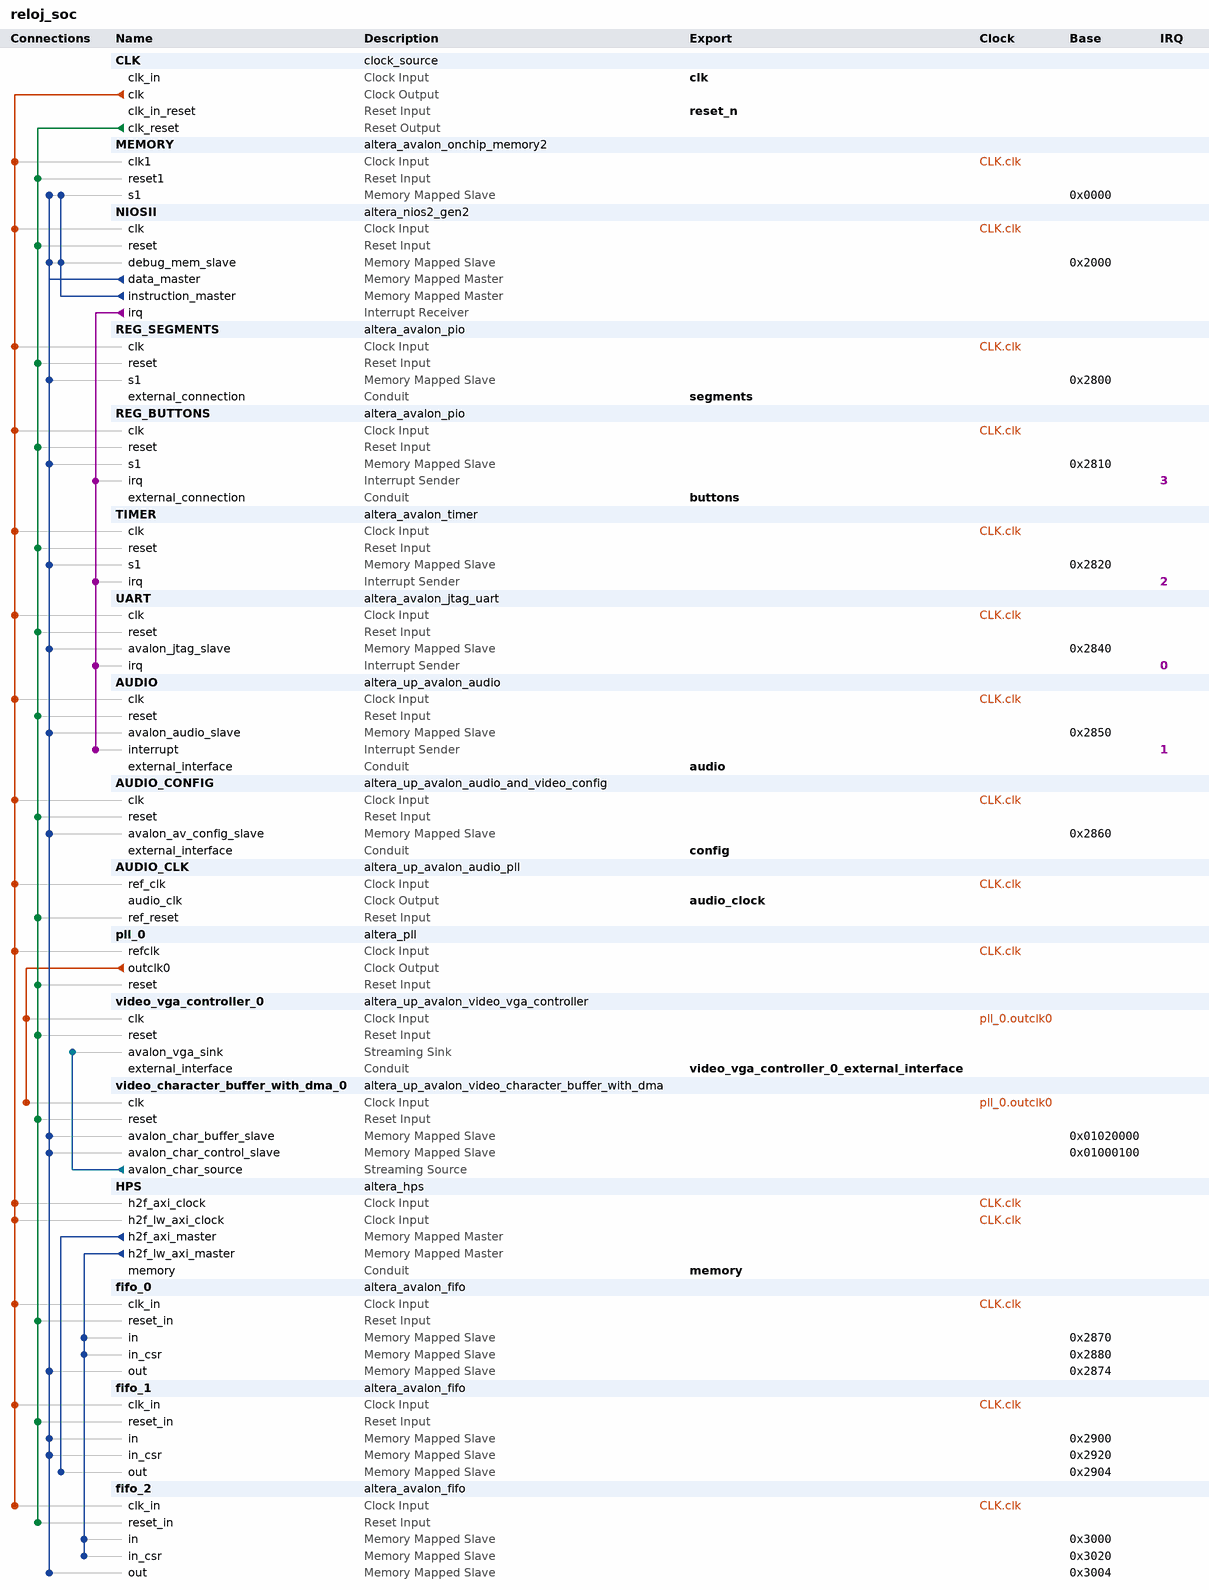
[diagram p0: system contents]
# Platform Designer (Qsys) system reloj_soc, Cyclone V 5CSEMA5F31C6
# Parameters at their usual value, and those the tool derives, are not listed.
package require -exact qsys 18.1
create_system reloj_soc
set_project_property DEVICE_FAMILY {Cyclone V}
set_project_property DEVICE 5CSEMA5F31C6

add_instance CLK clock_source 18.1
set_instance_parameter_value CLK clockFrequency 50000000

add_instance MEMORY altera_avalon_onchip_memory2 18.1
set_instance_parameter_value MEMORY dataWidth 32
set_instance_parameter_value MEMORY dualPort false
set_instance_parameter_value MEMORY initMemContent true
set_instance_parameter_value MEMORY initializationFileName onchip_mem.hex
set_instance_parameter_value MEMORY memorySize 8192
set_instance_parameter_value MEMORY singleClockOperation true

add_instance NIOSII altera_nios2_gen2 18.1
set_instance_parameter_value NIOSII dcache_size 2048
set_instance_parameter_value NIOSII exceptionSlave MEMORY.s1
set_instance_parameter_value NIOSII icache_size 4096
set_instance_parameter_value NIOSII impl Tiny
set_instance_parameter_value NIOSII resetSlave MEMORY.s1

add_instance REG_SEGMENTS altera_avalon_pio 18.1
set_instance_parameter_value REG_SEGMENTS direction Output
set_instance_parameter_value REG_SEGMENTS width 28

add_instance REG_BUTTONS altera_avalon_pio 18.1
set_instance_parameter_value REG_BUTTONS bitClearingEdgeCapReg true
set_instance_parameter_value REG_BUTTONS captureEdge true
set_instance_parameter_value REG_BUTTONS direction Input
set_instance_parameter_value REG_BUTTONS edgeType FALLING
set_instance_parameter_value REG_BUTTONS generateIRQ true
set_instance_parameter_value REG_BUTTONS irqType EDGE
set_instance_parameter_value REG_BUTTONS width 4

add_instance TIMER altera_avalon_timer 18.1
set_instance_parameter_value TIMER fixedPeriod true
set_instance_parameter_value TIMER period 1
set_instance_parameter_value TIMER periodUnits SEC

add_instance UART altera_avalon_jtag_uart 18.1
set_instance_parameter_value UART simInteractiveOptions NO_INTERACTIVE_WINDOWS

add_instance AUDIO altera_up_avalon_audio 18.0
set_instance_parameter_value AUDIO audio_in true
set_instance_parameter_value AUDIO avalon_bus_type {Memory Mapped}
set_instance_parameter_value AUDIO dw 24

add_instance AUDIO_CONFIG altera_up_avalon_audio_and_video_config 18.0
set_instance_parameter_value AUDIO_CONFIG audio_in {Microphone to ADC}
set_instance_parameter_value AUDIO_CONFIG bit_length 24
set_instance_parameter_value AUDIO_CONFIG board DE1-SoC
set_instance_parameter_value AUDIO_CONFIG line_in_bypass false
set_instance_parameter_value AUDIO_CONFIG sampling_rate {48 kHz}

add_instance AUDIO_CLK altera_up_avalon_audio_pll 18.0
set_instance_parameter_value AUDIO_CLK gui_refclk 50.0

add_instance pll_0 altera_pll 18.1
set_instance_parameter_value pll_0 gui_device_speed_grade 1
set_instance_parameter_value pll_0 gui_number_of_clocks 1
set_instance_parameter_value pll_0 gui_operation_mode direct
set_instance_parameter_value pll_0 gui_output_clock_frequency0 25.0
set_instance_parameter_value pll_0 gui_pll_mode {Integer-N PLL}
set_instance_parameter_value pll_0 gui_reference_clock_frequency 50.0
set_instance_parameter_value pll_0 gui_use_locked true

add_instance video_vga_controller_0 altera_up_avalon_video_vga_controller 18.0
set_instance_parameter_value video_vga_controller_0 board DE1-SoC
set_instance_parameter_value video_vga_controller_0 resolution {VGA 640x480}

add_instance video_character_buffer_with_dma_0 altera_up_avalon_video_character_buffer_with_dma 18.0
set_instance_parameter_value video_character_buffer_with_dma_0 enable_transparency false

add_instance HPS altera_hps 18.1
set_instance_parameter_value HPS EMAC1_Mode N/A
set_instance_parameter_value HPS EMAC1_PinMuxing Unused
set_instance_parameter_value HPS F2SCLK_COLDRST_Enable false
set_instance_parameter_value HPS F2SCLK_DBGRST_Enable false
set_instance_parameter_value HPS F2SCLK_WARMRST_Enable false
set_instance_parameter_value HPS F2SINTERRUPT_Enable false
set_instance_parameter_value HPS F2S_Width 0
set_instance_parameter_value HPS FPGA_PERIPHERAL_OUTPUT_CLOCK_FREQ_EMAC0_GTX_CLK 125
set_instance_parameter_value HPS FPGA_PERIPHERAL_OUTPUT_CLOCK_FREQ_EMAC0_MD_CLK 2.5
set_instance_parameter_value HPS FPGA_PERIPHERAL_OUTPUT_CLOCK_FREQ_EMAC1_GTX_CLK 125
set_instance_parameter_value HPS FPGA_PERIPHERAL_OUTPUT_CLOCK_FREQ_EMAC1_MD_CLK 2.5
set_instance_parameter_value HPS HPS_PROTOCOL DDR3
set_instance_parameter_value HPS I2C0_Mode N/A
set_instance_parameter_value HPS I2C0_PinMuxing Unused
set_instance_parameter_value HPS I2C1_Mode N/A
set_instance_parameter_value HPS I2C1_PinMuxing Unused
set_instance_parameter_value HPS LWH2F_Enable true
set_instance_parameter_value HPS MEM_BANKADDR_WIDTH 3
set_instance_parameter_value HPS MEM_CLK_FREQ 300.0
set_instance_parameter_value HPS MEM_CLK_FREQ_MAX 400.0
set_instance_parameter_value HPS MEM_COL_ADDR_WIDTH 8
set_instance_parameter_value HPS MEM_DQ_WIDTH 8
set_instance_parameter_value HPS MEM_DRV_STR RZQ/6
set_instance_parameter_value HPS MEM_ROW_ADDR_WIDTH 12
set_instance_parameter_value HPS MEM_RTT_NOM {ODT Disabled}
set_instance_parameter_value HPS MEM_RTT_WR {Dynamic ODT off}
set_instance_parameter_value HPS MEM_TCL 7
set_instance_parameter_value HPS MEM_TFAW_NS 37.5
set_instance_parameter_value HPS MEM_TINIT_US 499
set_instance_parameter_value HPS MEM_TMRD_CK 3
set_instance_parameter_value HPS MEM_TRAS_NS 40.0
set_instance_parameter_value HPS MEM_TRCD_NS 15.0
set_instance_parameter_value HPS MEM_TREFI_US 7.0
set_instance_parameter_value HPS MEM_TRFC_NS 75.0
set_instance_parameter_value HPS MEM_TRP_NS 15.0
set_instance_parameter_value HPS MEM_TWTR 2
set_instance_parameter_value HPS MEM_VENDOR JEDEC
set_instance_parameter_value HPS MEM_WTCL 6
set_instance_parameter_value HPS QSPI_Mode N/A
set_instance_parameter_value HPS QSPI_PinMuxing Unused
set_instance_parameter_value HPS REF_CLK_FREQ 125.0
set_instance_parameter_value HPS S2FCLK_USER2CLK 5
set_instance_parameter_value HPS S2F_Width 1
set_instance_parameter_value HPS SDIO_Mode N/A
set_instance_parameter_value HPS SDIO_PinMuxing Unused
set_instance_parameter_value HPS SPIM1_Mode N/A
set_instance_parameter_value HPS SPIM1_PinMuxing Unused
set_instance_parameter_value HPS STM_Enable false
set_instance_parameter_value HPS TIMING_BOARD_AC_SKEW 0.02
set_instance_parameter_value HPS TIMING_BOARD_AC_TO_CK_SKEW 0.0
set_instance_parameter_value HPS TIMING_BOARD_DQ_TO_DQS_SKEW 0.0
set_instance_parameter_value HPS TIMING_BOARD_MAX_CK_DELAY 0.6
set_instance_parameter_value HPS TIMING_BOARD_MAX_DQS_DELAY 0.6
set_instance_parameter_value HPS TIMING_BOARD_SKEW_BETWEEN_DQS 0.02
set_instance_parameter_value HPS TIMING_BOARD_SKEW_CKDQS_DIMM_MAX 0.01
set_instance_parameter_value HPS TIMING_BOARD_SKEW_CKDQS_DIMM_MIN -0.01
set_instance_parameter_value HPS TIMING_BOARD_SKEW_WITHIN_DQS 0.02
set_instance_parameter_value HPS TIMING_TDH 125
set_instance_parameter_value HPS TIMING_TDQSCK 400
set_instance_parameter_value HPS TIMING_TDQSQ 120
set_instance_parameter_value HPS TIMING_TDS 50
set_instance_parameter_value HPS TIMING_TIH 250
set_instance_parameter_value HPS TIMING_TIS 175
set_instance_parameter_value HPS TIMING_TQSH 0.38
set_instance_parameter_value HPS UART0_Mode N/A
set_instance_parameter_value HPS UART0_PinMuxing Unused
set_instance_parameter_value HPS USB1_Mode N/A
set_instance_parameter_value HPS USB1_PinMuxing Unused
set_instance_parameter_value HPS desired_cfg_clk_mhz 100.0
set_instance_parameter_value HPS desired_qspi_clk_mhz 400.0
set_instance_parameter_value HPS eosc1_clk_mhz 50.0
set_instance_parameter_value HPS eosc2_clk_mhz 50.0

add_instance fifo_0 altera_avalon_fifo 18.1
set_instance_parameter_value fifo_0 bitsPerSymbol 16
set_instance_parameter_value fifo_0 channelWidth 8
set_instance_parameter_value fifo_0 errorWidth 8
set_instance_parameter_value fifo_0 fifoDepth 16
set_instance_parameter_value fifo_0 fifoInputInterfaceOptions AVALONMM_WRITE
set_instance_parameter_value fifo_0 fifoOutputInterfaceOptions AVALONMM_READ
set_instance_parameter_value fifo_0 singleClockMode true
set_instance_parameter_value fifo_0 symbolsPerBeat 2
set_instance_parameter_value fifo_0 useIRQ false
set_instance_parameter_value fifo_0 usePacket true
set_instance_parameter_value fifo_0 useReadControl false

add_instance fifo_1 altera_avalon_fifo 18.1
set_instance_parameter_value fifo_1 bitsPerSymbol 16
set_instance_parameter_value fifo_1 channelWidth 8
set_instance_parameter_value fifo_1 errorWidth 8
set_instance_parameter_value fifo_1 fifoDepth 16
set_instance_parameter_value fifo_1 fifoInputInterfaceOptions AVALONMM_WRITE
set_instance_parameter_value fifo_1 fifoOutputInterfaceOptions AVALONMM_READ
set_instance_parameter_value fifo_1 singleClockMode true
set_instance_parameter_value fifo_1 symbolsPerBeat 2
set_instance_parameter_value fifo_1 useIRQ false
set_instance_parameter_value fifo_1 usePacket true
set_instance_parameter_value fifo_1 useReadControl false

add_instance fifo_2 altera_avalon_fifo 18.1
set_instance_parameter_value fifo_2 bitsPerSymbol 16
set_instance_parameter_value fifo_2 channelWidth 8
set_instance_parameter_value fifo_2 errorWidth 8
set_instance_parameter_value fifo_2 fifoDepth 16
set_instance_parameter_value fifo_2 fifoInputInterfaceOptions AVALONMM_WRITE
set_instance_parameter_value fifo_2 fifoOutputInterfaceOptions AVALONMM_READ
set_instance_parameter_value fifo_2 singleClockMode true
set_instance_parameter_value fifo_2 symbolsPerBeat 2
set_instance_parameter_value fifo_2 useIRQ false
set_instance_parameter_value fifo_2 usePacket true
set_instance_parameter_value fifo_2 useReadControl false

# connections
add_connection CLK.clk AUDIO.clk clock
add_connection CLK.clk AUDIO_CLK.ref_clk clock
add_connection CLK.clk AUDIO_CONFIG.clk clock
add_connection CLK.clk fifo_0.clk_in clock
add_connection CLK.clk fifo_1.clk_in clock
add_connection CLK.clk fifo_2.clk_in clock
add_connection CLK.clk HPS.h2f_axi_clock clock
add_connection CLK.clk HPS.h2f_lw_axi_clock clock
add_connection CLK.clk MEMORY.clk1 clock
add_connection CLK.clk NIOSII.clk clock
add_connection CLK.clk pll_0.refclk clock
add_connection CLK.clk REG_BUTTONS.clk clock
add_connection CLK.clk REG_SEGMENTS.clk clock
add_connection CLK.clk TIMER.clk clock
add_connection CLK.clk UART.clk clock
add_connection pll_0.outclk0 video_character_buffer_with_dma_0.clk clock
add_connection pll_0.outclk0 video_vga_controller_0.clk clock
add_connection CLK.clk_reset AUDIO.reset reset
add_connection CLK.clk_reset AUDIO_CLK.ref_reset reset
add_connection CLK.clk_reset AUDIO_CONFIG.reset reset
add_connection CLK.clk_reset fifo_0.reset_in reset
add_connection CLK.clk_reset fifo_1.reset_in reset
add_connection CLK.clk_reset fifo_2.reset_in reset
add_connection CLK.clk_reset MEMORY.reset1 reset
add_connection CLK.clk_reset NIOSII.reset reset
add_connection CLK.clk_reset pll_0.reset reset
add_connection CLK.clk_reset REG_BUTTONS.reset reset
add_connection CLK.clk_reset REG_SEGMENTS.reset reset
add_connection CLK.clk_reset TIMER.reset reset
add_connection CLK.clk_reset UART.reset reset
add_connection CLK.clk_reset video_character_buffer_with_dma_0.reset reset
add_connection CLK.clk_reset video_vga_controller_0.reset reset
add_connection HPS.h2f_axi_master fifo_1.out avalon
set_connection_parameter_value HPS.h2f_axi_master/fifo_1.out baseAddress 0x2904
add_connection HPS.h2f_lw_axi_master fifo_0.in avalon
set_connection_parameter_value HPS.h2f_lw_axi_master/fifo_0.in baseAddress 0x2870
add_connection HPS.h2f_lw_axi_master fifo_0.in_csr avalon
set_connection_parameter_value HPS.h2f_lw_axi_master/fifo_0.in_csr baseAddress 0x2880
add_connection HPS.h2f_lw_axi_master fifo_2.in avalon
set_connection_parameter_value HPS.h2f_lw_axi_master/fifo_2.in baseAddress 0x3000
add_connection HPS.h2f_lw_axi_master fifo_2.in_csr avalon
set_connection_parameter_value HPS.h2f_lw_axi_master/fifo_2.in_csr baseAddress 0x3020
add_connection NIOSII.data_master AUDIO.avalon_audio_slave avalon
set_connection_parameter_value NIOSII.data_master/AUDIO.avalon_audio_slave baseAddress 0x2850
add_connection NIOSII.data_master AUDIO_CONFIG.avalon_av_config_slave avalon
set_connection_parameter_value NIOSII.data_master/AUDIO_CONFIG.avalon_av_config_slave baseAddress 0x2860
add_connection NIOSII.data_master fifo_0.out avalon
set_connection_parameter_value NIOSII.data_master/fifo_0.out baseAddress 0x2874
add_connection NIOSII.data_master fifo_1.in avalon
set_connection_parameter_value NIOSII.data_master/fifo_1.in baseAddress 0x2900
add_connection NIOSII.data_master fifo_1.in_csr avalon
set_connection_parameter_value NIOSII.data_master/fifo_1.in_csr baseAddress 0x2920
add_connection NIOSII.data_master fifo_2.out avalon
set_connection_parameter_value NIOSII.data_master/fifo_2.out baseAddress 0x3004
add_connection NIOSII.data_master MEMORY.s1 avalon
set_connection_parameter_value NIOSII.data_master/MEMORY.s1 baseAddress 0x0000
add_connection NIOSII.data_master NIOSII.debug_mem_slave avalon
set_connection_parameter_value NIOSII.data_master/NIOSII.debug_mem_slave baseAddress 0x2000
add_connection NIOSII.data_master REG_BUTTONS.s1 avalon
set_connection_parameter_value NIOSII.data_master/REG_BUTTONS.s1 baseAddress 0x2810
add_connection NIOSII.data_master REG_SEGMENTS.s1 avalon
set_connection_parameter_value NIOSII.data_master/REG_SEGMENTS.s1 baseAddress 0x2800
add_connection NIOSII.data_master TIMER.s1 avalon
set_connection_parameter_value NIOSII.data_master/TIMER.s1 baseAddress 0x2820
add_connection NIOSII.data_master UART.avalon_jtag_slave avalon
set_connection_parameter_value NIOSII.data_master/UART.avalon_jtag_slave baseAddress 0x2840
add_connection NIOSII.data_master video_character_buffer_with_dma_0.avalon_char_buffer_slave avalon
set_connection_parameter_value NIOSII.data_master/video_character_buffer_with_dma_0.avalon_char_buffer_slave baseAddress 0x01020000
add_connection NIOSII.data_master video_character_buffer_with_dma_0.avalon_char_control_slave avalon
set_connection_parameter_value NIOSII.data_master/video_character_buffer_with_dma_0.avalon_char_control_slave baseAddress 0x01000100
add_connection NIOSII.instruction_master MEMORY.s1 avalon
set_connection_parameter_value NIOSII.instruction_master/MEMORY.s1 baseAddress 0x0000
add_connection NIOSII.instruction_master NIOSII.debug_mem_slave avalon
set_connection_parameter_value NIOSII.instruction_master/NIOSII.debug_mem_slave baseAddress 0x2000
add_connection video_character_buffer_with_dma_0.avalon_char_source video_vga_controller_0.avalon_vga_sink avalon_streaming
add_connection NIOSII.irq AUDIO.interrupt interrupt
set_connection_parameter_value NIOSII.irq/AUDIO.interrupt irqNumber 1
add_connection NIOSII.irq REG_BUTTONS.irq interrupt
set_connection_parameter_value NIOSII.irq/REG_BUTTONS.irq irqNumber 3
add_connection NIOSII.irq TIMER.irq interrupt
set_connection_parameter_value NIOSII.irq/TIMER.irq irqNumber 2
add_connection NIOSII.irq UART.irq interrupt
set_connection_parameter_value NIOSII.irq/UART.irq irqNumber 0

# exported interfaces
add_interface audio conduit end
set_interface_property audio EXPORT_OF AUDIO.external_interface
add_interface audio_clock clock source
set_interface_property audio_clock EXPORT_OF AUDIO_CLK.audio_clk
add_interface buttons conduit end
set_interface_property buttons EXPORT_OF REG_BUTTONS.external_connection
add_interface clk clock sink
set_interface_property clk EXPORT_OF CLK.clk_in
add_interface config conduit end
set_interface_property config EXPORT_OF AUDIO_CONFIG.external_interface
add_interface memory conduit end
set_interface_property memory EXPORT_OF HPS.memory
add_interface reset_n reset sink
set_interface_property reset_n EXPORT_OF CLK.clk_in_reset
add_interface segments conduit end
set_interface_property segments EXPORT_OF REG_SEGMENTS.external_connection
add_interface video_vga_controller_0_external_interface conduit end
set_interface_property video_vga_controller_0_external_interface EXPORT_OF video_vga_controller_0.external_interface

set_interconnect_requirement {$system} qsys_mm.clockCrossingAdapter HANDSHAKE
set_interconnect_requirement {$system} qsys_mm.enableEccProtection FALSE
set_interconnect_requirement {$system} qsys_mm.insertDefaultSlave FALSE
set_interconnect_requirement {$system} qsys_mm.maxAdditionalLatency 1

save_system reloj_soc.qsys
